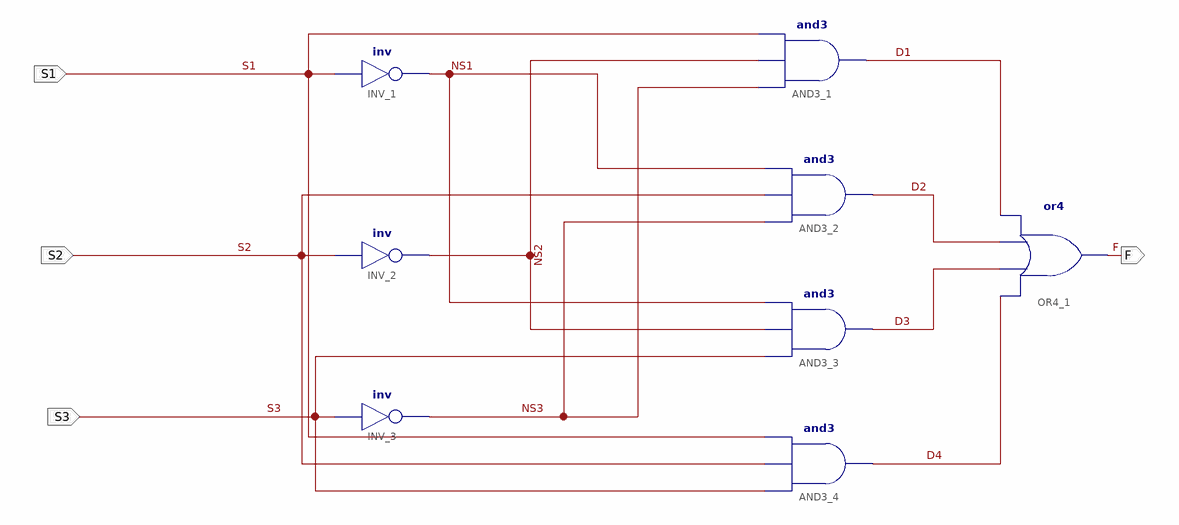
[diagram p0: schematic sheet 1]
// Xilinx ISE schematic LampCtrl.sch (kintex7) as structural Verilog: 8 symbols, 4 ports
module LampCtrl (
  input  S1,
  input  S2,
  input  S3,
  output F
);

  wire D1, D2, D3, D4, NS1, NS2, NS3;

  not INV_1 (NS1, S1);
  not INV_2 (NS2, S2);
  not INV_3 (NS3, S3);
  and AND3_1 (D1, NS3, NS2, S1);
  and AND3_2 (D2, NS3, S2, NS1);
  and AND3_3 (D3, S3, NS2, NS1);
  and AND3_4 (D4, S3, S2, S1);
  or OR4_1 (F, D4, D3, D2, D1);
endmodule
